# Altium schematic sheet rev02_1.SchDoc
size 409 x 282 mm
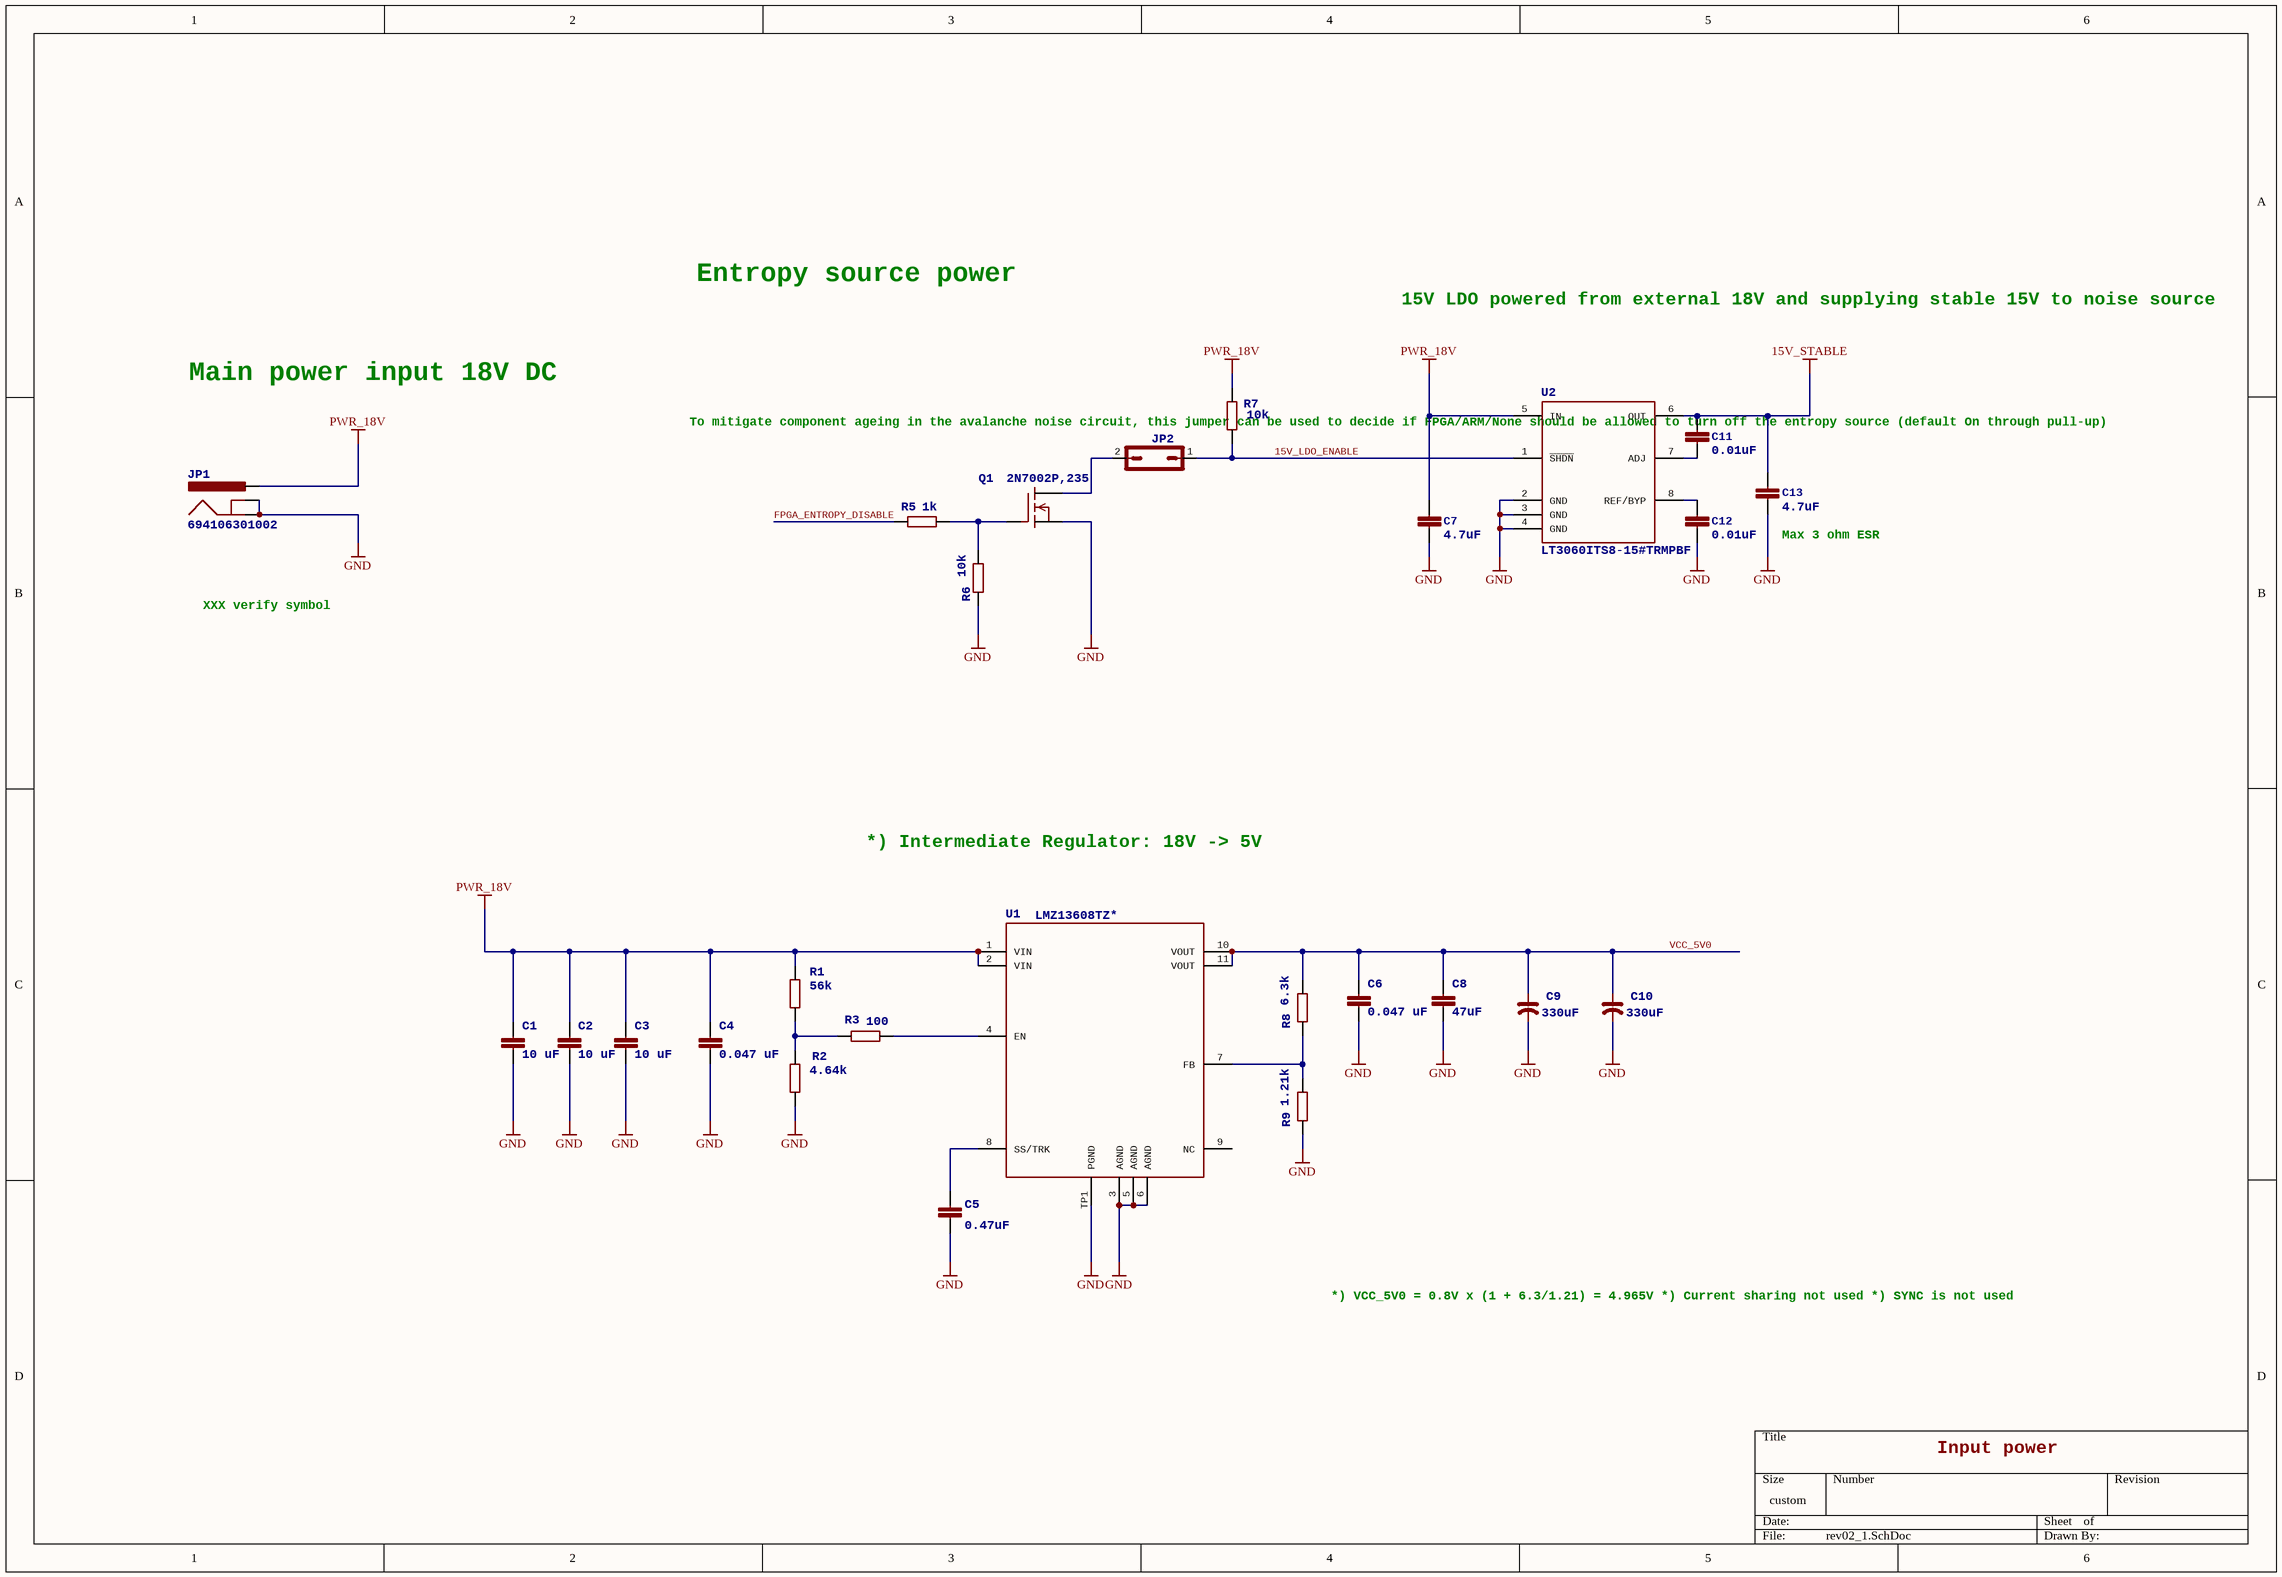
[diagram p0: rev02_1.SchDoc]

## Parts
C1  value 10 uF  >NAME: C1  [C_1210]
C2  value 10 uF  >NAME: C2  [C_1210]
C3  value 10 uF  >NAME: C3  [C_1210]
C4  value 0.047 uF  >NAME: C4  [C_0402]
C5  value 0.47uF  [C_0402]  (hidden comment: GRM155R61A474KE15D)
C6  value 0.047 uF  >NAME: C6  [C_0402]
C7  value 4.7uF  [C_0805]  (hidden comment: TMK212AB7475KG-T)
C8  value 47uF  >NAME: C8  [C_1210]  (hidden comment: GRM32ER70J476ME20L)
C9  value 330uF  [C_D]  (hidden comment: T520D337M006ATE015)
C10  value 330uF  [C_D]  (hidden comment: T520D337M006ATE015)
C11  value 0.01uF  [C_0402]
C12  value 0.01uF  [C_0402]
C13  value 4.7uF  [C_0805]  (hidden comment: TMK212AB7475KG-T)
JP1  694106301002  [694106301002]
JP2  >NAME: JP2  [PLS-2]  (hidden comment: 61300211121)
Q1  2N7002P,235  >NAME: Q1  [SOT-23]
R1  value 56k  [R_0402]
R2  value 4.64k  [R_0402]
R3  value 100  >NAME: R3  [R_0402]
R5  value 1k  [R_0402]
R6  value 10k  >NAME: R6  [R_0402]
R7  value 10k  >NAME: R7  [R_0402]
R8  value 6.3k  [R_0402]
R9  value 1.21k  [R_0402]
U1  LMZ13608TZ*  [NDY]
U2  LT3060ITS8-15#TRMPBF  [TSOT-8-23]

## Nets
15V_STABLE: C11.2 C13.1 U2.6(OUT)
GND: C1.2 C2.2 C3.2 C4.2 C5.2 C6.2 C7.2 C8.2 C9.2(-) C10.2(-) C12.1 C13.2 JP1.2(GND) JP1.3(GNDBREAK) Q1.2(S) R2.1 R6.2 R9.1 U1.3(AGND) U1.5(AGND) U1.6(AGND) U1.TP1(PGND) U2.2(GND) U2.3(GND) U2.4(GND)
PWR_18V: C1.1 C2.1 C3.1 C4.1 C7.1 JP1.1(PWR) R1.2 R7.1 U1.1(VIN) U1.2(VIN) U2.5(IN)
15V_LDO_ENABLE: JP2.1 R7.2 U2.1(~{SHDN})
FPGA_ENTROPY_DISABLE: R5.1
VCC_5V0: C6.1 C8.1 C9.1(+) C10.1(+) R8.2 U1.10(VOUT) U1.11(VOUT)
NetC5_1: C5.1 U1.8(SS/TRK)
NetC11_1: C11.1 U2.7(ADJ)
NetC12_2: C12.2 U2.8(REF/BYP)
NetJP2_2: JP2.2 Q1.3(D)
NetQ1_1: Q1.1(G) R5.2 R6.1
NetR1_1: R1.1 R2.2 R3.1
NetR3_2: R3.2 U1.4(EN)
NetR8_1: R8.1 R9.2 U1.7(FB)

Not connected (* = marked no-connect by the designer): U1 9(NC)

## Notes on the sheet
- Entropy source power
- 15V LDO powered from external 18V
  and supplying stable 15V to noise source
- Main power input
  18V DC
- To mitigate component ageing in the avalanche noise circuit,
  this jumper can be used to decide if FPGA/ARM/None should
  be allowed to turn off the entropy source
  (default On through pull-up)
- (near C13) Max 3 ohm ESR
- XXX verify symbol
- *) Intermediate Regulator: 18V -> 5V
- *) VCC_5V0 = 0.8V x (1 + 6.3/1.21) = 4.965V
  *) Current sharing not used
  *) SYNC is not used
- Input power

## Library data of the parts
C1-C3 = C-EUC1210: 1210 CAPACITOR; DIELECTRIC: X7R; RATED_VOLTAGE: 50V; TOLERANCE: 10%
C4 C6 = C-EUC0402: 0402 CAPACITOR; DIELECTRIC: X7R; RATED_VOLTAGE: 50V; TOLERANCE: 10%
C5 = C-EUC0402: 0402 CAPACITOR; DIELECTRIC: X5R; RATED_VOLTAGE: 6.3V; TOLERANCE: 10%; >NAME: C124
C7 C13 = C-EUC0603: 0805 CAPACITOR X7R 25V
C8 = C-EUC1210: 1210 CAPACITOR X5R 6.3V; RATED_VOLTAGE: 16V; TOLERANCE: 20%; DIELECTRIC: X5R
C9 C10 = CP_E-035X080: Kemet Tantalum Capacitor
C11 C12 = C-EUC0402: 0402 CAPACITOR
JP1 = POWER_JACKSMD: Wurth Power Connector 5.5x2.1mm Barrel; PROD_ID: CONN-08106; SF_ID: PRT-12748
JP2 = JP1Q: Wurth 2pins connector (for jumper); >VALUE: JP1Q
Q1 = 2N7002: OnSemi FET; >VALUE: 2N7002
R1 R2 R8 R9 = R-EU_R0402: 0402 Resistor 1%
R3 R5-R7 = R-EU_R0402: 0402 Resistor 5%
  R3 R6 R7: TOLERANCE: 5%
U1 = LMZ13608: 8-A SIMPLE SWITCHER® Power Module With 36-V Maximum Input Voltage; MPN: LMZ13608TZ/NOPB; OC_FARNELL: 2492265; PACKAGE: NDY (11); SUPPLIER: Texas Instruments
U2 = LT3060ITS8-15: Micropower, Low Noise, 100mA LDO, Linear Regulator; SUPPLIER: Linear Technology; MPN: LT3060ITS8-15#TRMPBF; OC_FARNELL: 2471073